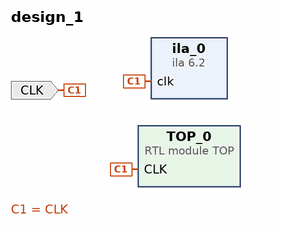
[diagram p0: block diagram of the top level]
# Vivado block design design_1, xc7a100tcsg324-3, Vivado 2021.2
create_bd_design design_1

create_bd_port -dir I -type clk CLK
set_property -dict {CONFIG.FREQ_HZ 100000000} [get_bd_ports CLK]

create_bd_cell -type ip -vlnv xilinx.com:ip:ila:6.2 ila_0
set_property -dict {CONFIG.C_ENABLE_ILA_AXI_MON false CONFIG.C_MONITOR_TYPE Native CONFIG.C_NUM_OF_PROBES 5} [get_bd_cells ila_0]
create_bd_cell -type module -reference TOP TOP_0

# ---- connections ----

connect_bd_net [get_bd_ports CLK] [get_bd_pins ila_0/clk] [get_bd_pins TOP_0/CLK]

validate_bd_design
save_bd_design
